# EAGLE schematic A1- Ricky A-Schematic (EAGLE 7.0.0)
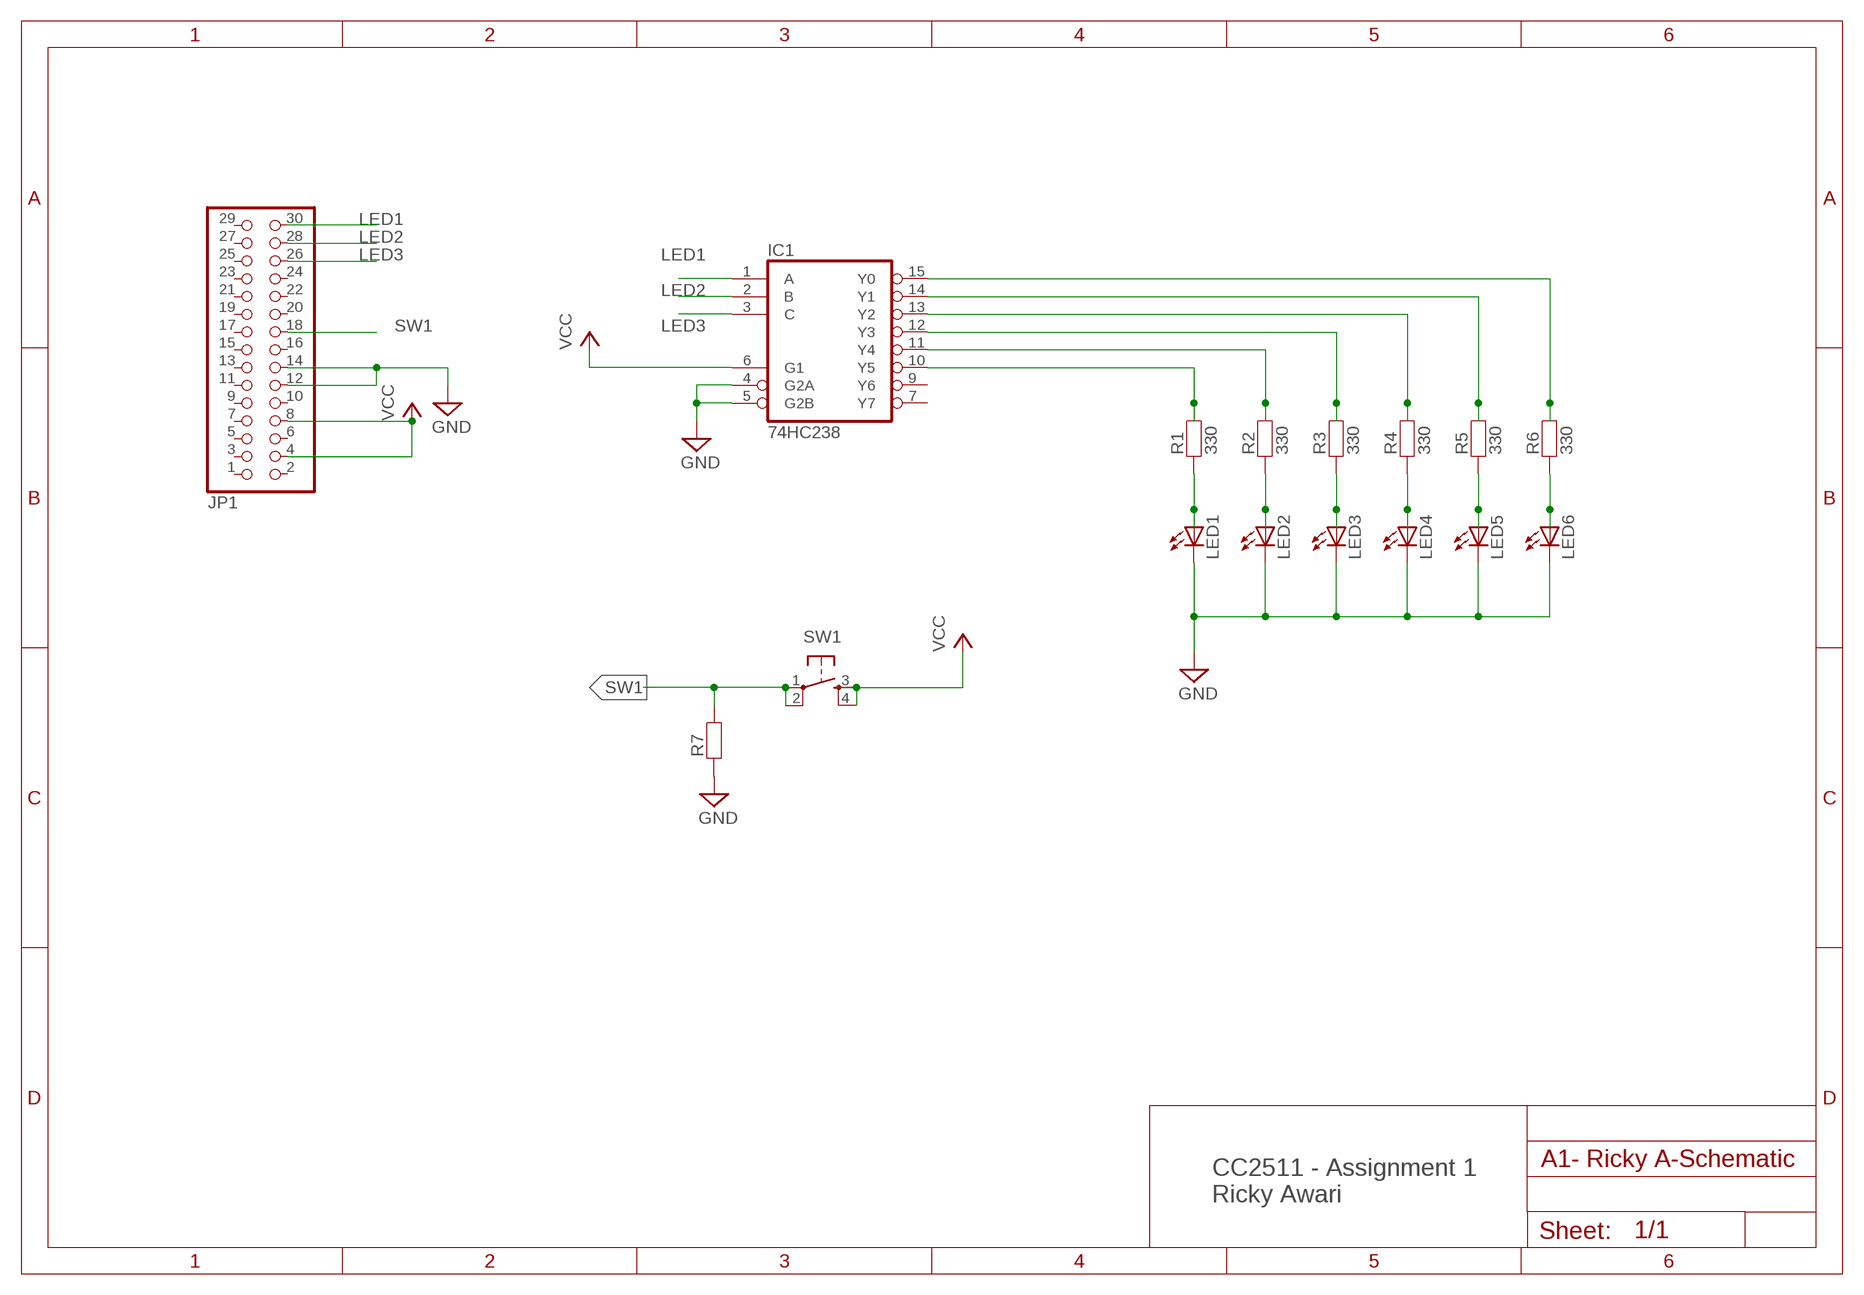
[diagram p0: schematic, sheet 1]

## Parts
IC1  74HC238  74HC138N  [DIL16]
JP1  PINHD-2X15  [2X15]
LED1  LED-5MM  [LED-5MM]
LED2  LED-5MM  [LED-5MM]
LED3  LED-5MM  [LED-5MM]
LED4  LED-5MM  [LED-5MM]
LED5  LED-5MM  [LED-5MM]
LED6  LED-5MM  [LED-5MM]
R1  330  RESISTOR-AXIAL-0.4  [AXIAL-0.4]
R2  330  RESISTOR-AXIAL-0.4  [AXIAL-0.4]
R3  330  RESISTOR-AXIAL-0.4  [AXIAL-0.4]
R4  330  RESISTOR-AXIAL-0.4  [AXIAL-0.4]
R5  330  RESISTOR-AXIAL-0.4  [AXIAL-0.4]
R6  330  RESISTOR-AXIAL-0.4  [AXIAL-0.4]
R7  RESISTOR-AXIAL-0.4  [AXIAL-0.4]
SW1  TAC_SWITCHPTH  [TACTILE-PTH]

## Nets
GND: IC1.4(G2A) IC1.5(G2B) JP1.12 JP1.14 LED1.C LED2.C LED3.C LED4.C LED5.C LED6.C R7.P$1
LED1: IC1.1(A) JP1.30
LED2: IC1.2(B) JP1.28
LED3: IC1.3(C) JP1.26
N$1: IC1.10(Y5) R1.P$2
N$2: IC1.11(Y4) R2.P$2
N$3: IC1.12(Y3) R3.P$2
N$4: IC1.13(Y2) R4.P$2
N$5: IC1.14(Y1) R5.P$2
N$6: IC1.15(Y0) R6.P$2
N$7: LED1.A R1.P$1
N$8: LED2.A R2.P$1
N$9: LED3.A R3.P$1
N$10: LED4.A R4.P$1
N$11: LED5.A R5.P$1
N$12: LED6.A R6.P$1
SW1: JP1.18 R7.P$2 SW1.1 SW1.2
VCC: IC1.6(G1) JP1.4 JP1.8 SW1.3 SW1.4
Unconnected: IC1.7(Y7) IC1.9(Y6) JP1.1 JP1.2 JP1.3 JP1.5 JP1.6 JP1.7 JP1.9 JP1.10 JP1.11 JP1.13 JP1.15 JP1.16 JP1.17 JP1.19 JP1.20 JP1.21 JP1.22 JP1.23 JP1.24 JP1.25 JP1.27 JP1.29

## Notes on the sheet
- CC2511 - Assignment 1
  Ricky Awari

## Power pins joined to a net without a drawn wire
GND: IC1.8(GND)
VCC: IC1.16(VCC)

## Library data of the parts
IC1 = 74xx-eu:74*138: 3-line to 8-line DECODER/DEMULTIPLEXER
JP1 = pinhead:PINHD-2X15: PIN HEADER
LED1-LED6 = JCU:LED: LED
R1-R7 = JCU:RESISTOR
SW1 = SparkFun-Electromechanical:TAC_SWITCH: Momentary Switch Button commonly used for reset or general input. Spark Fun Electronics SKU : COM-00097 SMT- SWCH-08247